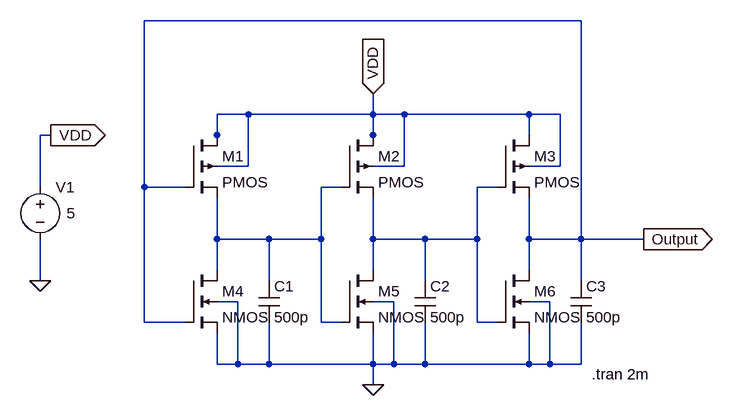
[diagram p0: schematic Ring_oscillator.asc]
Ring_oscillator.asc, the LTspice schematic file:
Version 4
SHEET 1 880 680
WIRE 624 -176 -48 -176
WIRE 112 -32 64 -32
WIRE 304 -32 304 -64
WIRE 304 -32 112 -32
WIRE 352 -32 304 -32
WIRE 544 -32 352 -32
WIRE 592 -32 544 -32
WIRE -192 0 -208 0
WIRE 64 0 64 -32
WIRE 304 0 304 -32
WIRE 544 0 544 -32
WIRE 64 16 64 0
WIRE 304 16 304 0
WIRE 112 48 112 -32
WIRE 112 48 64 48
WIRE 352 48 352 -32
WIRE 352 48 304 48
WIRE 592 48 592 -32
WIRE 592 48 544 48
WIRE -208 80 -208 0
WIRE -48 80 -48 -176
WIRE 16 80 -48 80
WIRE 256 80 224 80
WIRE 496 80 464 80
WIRE 64 160 64 96
WIRE 144 160 64 160
WIRE 224 160 224 80
WIRE 224 160 144 160
WIRE 304 160 304 96
WIRE 384 160 304 160
WIRE 464 160 464 80
WIRE 464 160 384 160
WIRE 544 160 544 96
WIRE 624 160 624 -176
WIRE 624 160 544 160
WIRE 720 160 624 160
WIRE 64 208 64 160
WIRE 304 208 304 160
WIRE 544 208 544 160
WIRE -208 224 -208 160
WIRE 144 224 144 160
WIRE 384 224 384 160
WIRE 624 224 624 160
WIRE 96 256 64 256
WIRE 336 256 304 256
WIRE 576 256 544 256
WIRE -48 288 -48 80
WIRE 16 288 -48 288
WIRE 224 288 224 160
WIRE 256 288 224 288
WIRE 464 288 464 160
WIRE 496 288 464 288
WIRE 64 352 64 304
WIRE 96 352 96 256
WIRE 96 352 64 352
WIRE 144 352 144 288
WIRE 144 352 96 352
WIRE 304 352 304 304
WIRE 304 352 144 352
WIRE 336 352 336 256
WIRE 336 352 304 352
WIRE 384 352 384 288
WIRE 384 352 336 352
WIRE 544 352 544 304
WIRE 544 352 384 352
WIRE 576 352 576 256
WIRE 576 352 544 352
WIRE 624 352 624 288
WIRE 624 352 576 352
WIRE 304 384 304 352
FLAG 304 384 0
FLAG -208 224 0
FLAG 304 -64 VDD
IOPIN 304 -64 In
FLAG 720 160 Output
IOPIN 720 160 Out
FLAG -192 0 VDD
IOPIN -192 0 Out
SYMBOL voltage -208 64 R0
WINDOW 123 0 0 Left 0
WINDOW 39 0 0 Left 0
WINDOW 3 41 56 Left 2
SYMATTR Value 5
SYMATTR InstName V1
SYMBOL cap 128 224 R0
SYMATTR InstName C1
SYMATTR Value 500p
SYMBOL cap 368 224 R0
SYMATTR InstName C2
SYMATTR Value 500p
SYMBOL cap 608 224 R0
SYMATTR InstName C3
SYMATTR Value 500p
SYMBOL pmos4 16 0 R0
SYMATTR InstName M1
SYMBOL pmos4 256 0 R0
SYMATTR InstName M2
SYMBOL pmos4 496 0 R0
SYMATTR InstName M3
SYMBOL nmos4 16 208 R0
SYMATTR InstName M4
SYMBOL nmos4 256 208 R0
SYMATTR InstName M5
SYMBOL nmos4 496 208 R0
SYMATTR InstName M6
TEXT 640 368 Left 2 !.tran 2m

The netlist it stands for:
* Ring_oscillator.asc
V1 VDD 0 5
C1 N001 0 500p
C2 N002 0 500p
C3 Output 0 500p
M1 VDD Output N001 VDD PMOS
M2 VDD N001 N002 VDD PMOS
M3 VDD N002 Output VDD PMOS
M4 N001 Output 0 0 NMOS
M5 N002 N001 0 0 NMOS
M6 Output N002 0 0 NMOS
.model NMOS NMOS
.model PMOS PMOS
.lib standard.mos
.tran 2m
.backanno
.end